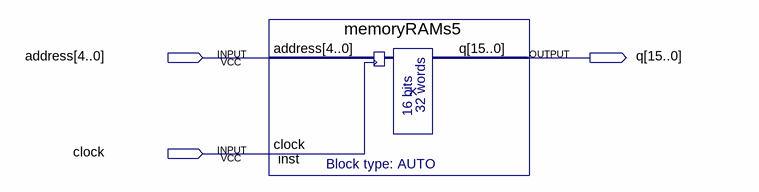
[diagram p0: schematic sheet]
// Quartus schematic TestMemoriaROM.bdf as structural Verilog: 1 symbols, 3 pins
module TestMemoriaROM (
  input  [4:0] address,
  input  clock,
  output [15:0] q
);

  memoryRAMs5 inst (.address(address), .clock(clock), .q(q));
endmodule
